# Altium schematic sheet nucleo_es_egyszerubb_dolgok.SchDoc
size A4
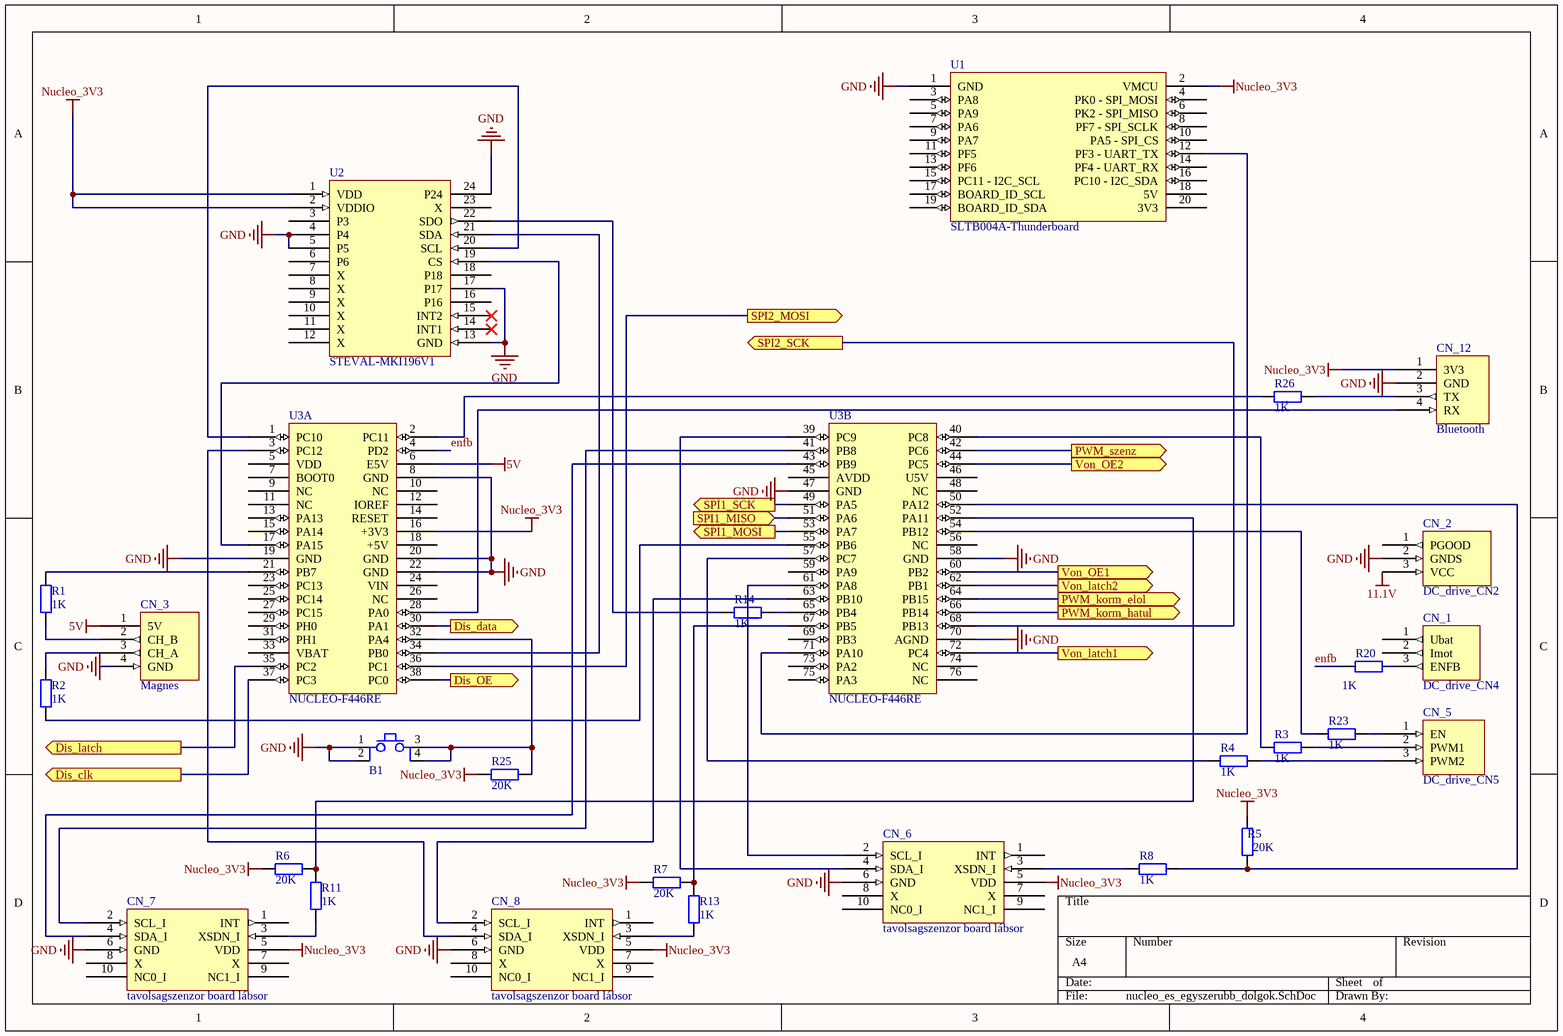
[diagram p0: nucleo_es_egyszerubb_dolgok.SchDoc]

## Parts
B1  Button  [FP_BTN_SMD]  (value not drawn)
CN_1  DC_drive_CN4  [DC_Drive_CN_Stelvio]
CN_2  DC_drive_CN2  [DC_Drive_CN_Stelvio]
CN_3  Magnes  [FP_CONN4_TAP_254MM]
CN_5  DC_drive_CN5  [DC_Drive_CN_Stelvio]
CN_6  tavolsagszenzor board lábsor  [6P konnektor (távolságszenzor)]
CN_7  tavolsagszenzor board lábsor  [6P konnektor (távolságszenzor)]
CN_8  tavolsagszenzor board lábsor  [6P konnektor (távolságszenzor)]
CN_12  Bluetooth  [FP_CONN4_TAP_254MM_90]
R1  1K  [FP_0603_RES]
R2  1K  [FP_0603_RES]
R3  1K  [FP_0603_RES]
R4  1K  [FP_0603_RES]
R5  20K  [FP_0603_RES]
R6  20K  [FP_0603_RES]
R7  20K  [FP_0603_RES]
R8  1K  [FP_0603_RES]
R11  1K  [FP_0603_RES]
R13  1K  [FP_0603_RES]
R14  1K  [FP_0603_RES]
R20  1K  [FP_0603_RES]
R23  1K  [FP_0603_RES]
R25  20K  [FP_0603_RES]
R26  1K  [FP_0603_RES]
U1  SLTB004A-Thunderboard  [SLTB004A]
U2  STEVAL-MKI196V1  [STEVAL IMU 20 tüske anya]
U3  NUCLEO-F446RE  [FP_NUCLEO-64]  (parts A,B of 2)

## Ports
Dis_clk (out), Dis_data (out), Dis_latch (out), Dis_OE (out), PWM_korm_elol (out), PWM_korm_hatul (out), PWM_szenz (out), SPI1_MISO (in), SPI1_MOSI (out), SPI1_SCK (out), SPI2_MOSI (out), SPI2_SCK (out), Von_latch1 (out), Von_latch2 (out), Von_OE1 (out), Von_OE2 (out)

## Nets
5V: CN_3.1(5V) U3.6(E5V)
11.1V: CN_2.3(VCC)
GND: B1.1 B1.2 CN_2.2(GNDS) CN_3.4(GND) CN_6.6(GND) CN_7.6(GND) CN_8.6(GND) CN_12.2(GND) U1.1(GND) U2.4(P4) U2.5(P5) U2.13(GND) U2.17(P17) U2.24(P24) U3.8(GND) U3.19(GND) U3.20(GND) U3.22(GND) U3.47(GND) U3.58(GND) U3.70(AGND)
Nucleo_3V3: CN_6.5(VDD) CN_7.5(VDD) CN_8.5(VDD) CN_12.1(3V3) R5.2 R6.1 R7.1 R25.1 U1.2(VMCU) U2.1(VDD) U2.2(VDDIO) U3.16(+3V3)
Dis_clk: U3.37(PC3) ; port Dis_clk
Dis_data: U3.30(PA1) ; port Dis_data
Dis_latch: U3.35(PC2) ; port Dis_latch
Dis_OE: U3.38(PC0) ; port Dis_OE
enfb: R20.1 U3.4(PD2)
PWM_korm_elol: U3.64(PB15) ; port PWM_korm_elol
PWM_korm_hatul: U3.66(PB14) ; port PWM_korm_hatul
PWM_szenz: U3.42(PC6) ; port PWM_szenz
SPI1_MISO: U3.51(PA6) ; port SPI1_MISO
SPI1_MOSI: U3.53(PA7) ; port SPI1_MOSI
SPI1_SCK: U3.49(PA5) ; port SPI1_SCK
SPI2_MOSI: U3.36(PC1) ; port SPI2_MOSI
SPI2_SCK: U3.68(PB13) ; port SPI2_SCK
Von_latch1: U3.72(PC4) ; port Von_latch1
Von_latch2: U3.62(PB1) ; port Von_latch2
Von_OE1: U3.60(PB2) ; port Von_OE1
Von_OE2: U3.44(PC5) ; port Von_OE2
NetB1_3: B1.3 B1.4 R25.2 U3.32(PA4)
NetCN_1_3: CN_1.3(ENFB) R20.2
NetCN_3_2: CN_3.2(CH_B) R1.1
NetCN_3_3: CN_3.3(CH_A) R2.2
NetCN_5_1: CN_5.1(EN) R23.2
NetCN_5_2: CN_5.2(PWM1) R3.2
NetCN_5_3: CN_5.3(PWM2) R4.2
NetCN_6_2: CN_6.2(SCL_I) U3.61(PA8)
NetCN_6_3: CN_6.3(XSDN_I) R8.1
NetCN_6_4: CN_6.4(SDA_I) U3.39(PC9)
NetCN_7_2: CN_7.2(SCL_I) U3.41(PB8)
NetCN_7_3: CN_7.3(XSDN_I) R11.1
NetCN_7_4: CN_7.4(SDA_I) U3.43(PB9)
NetCN_8_2: CN_8.2(SCL_I) U3.63(PB10)
NetCN_8_3: CN_8.3(XSDN_I) R13.1
NetCN_8_4: CN_8.4(SDA_I) U3.3(PC12)
NetCN_12_3: CN_12.3(TX) R26.2
NetCN_12_4: CN_12.4(RX) U3.28(PA0)
NetR1_2: R1.2 U3.21(PB7)
NetR2_1: R2.1 U3.55(PB6)
NetR3_1: R3.1 U3.40(PC8)
NetR4_1: R4.1 U3.57(PC7)
NetR5_1: R5.1 R8.2 U3.50(PA12)
NetR6_2: R6.2 R11.2 U3.52(PA11)
NetR7_2: R7.2 R13.2 U3.67(PB5)
NetR14_1: R14.1 U2.22(SDO)
NetR14_2: R14.2 U3.65(PB4)
NetR23_1: R23.1 U3.54(PB12)
NetR26_1: R26.1 U3.2(PC11)
NetU1_12: U1.12(PF3_-_UART_TX) U3.71(PA10)
NetU2_19: U2.19(CS) U3.17(PA15)
NetU2_20: U2.20(SCL) U3.1(PC10)
NetU2_21: U2.21(SDA) U3.34(PB0)

Not connected (* = marked no-connect by the designer): CN_1 1(Ubat) 2(Imot); CN_2 1(PGOOD); CN_6 1(INT) 7(X) 8(X) 9(NC1_I) 10(NC0_I); CN_7 1(INT) 7(X) 8(X) 9(NC1_I) 10(NC0_I); CN_8 1(INT) 7(X) 8(X) 9(NC1_I) 10(NC0_I); U1 3(PA8) 4(PK0_-_SPI_MOSI) 5(PA9) 6(PK2_-_SPI_MISO) 7(PA6) 8(PF7_-_SPI_SCLK) 9(PA7) 10(PA5_-_SPI_CS) 11(PF5) 13(PF6) 14(PF4_-_UART_RX) 15(PC11_-_I2C_SCL) 16(PC10_-_I2C_SDA) 17(BOARD_ID_SCL) 18(5V) 19(BOARD_ID_SDA) 20(3V3); U2 3(P3) 6(P6) 7(X) 8(X) 9(X) 10(X) 11(X) 12(X) 14(INT1)* 15(INT2)* 16(P16) 18(P18) 23(X); U3 5(VDD) 7(BOOT0) 9(NC) 10(NC) 11(NC) 12(IOREF) 13(PA13) 14(RESET) 15(PA14) 18(+5V) 23(PC13) 24(VIN) 25(PC14) 26(NC) 27(PC15) 29(PH0) 31(PH1) 33(VBAT) 45(AVDD) 46(U5V) 48(NC) 56(NC) 59(PA9) 69(PB3) 73(PA2) 74(NC) 75(PA3) 76(NC)

## Library data of the parts
B1 = Button 4P: Push button
CN_1 = DC_drive_CN4: CN4 a motvez kártyán a neve
CN_2 = DC_drive_CN2: CN2 a motvez kártyán a neve; supplier: AUT
CN_3 = Encoder: A1333; Supplier: AUT
CN_5 = DC_drive_CN5: CN5 a motvez kártyán a neve; supplier: AUT
CN_6-CN_8 = VL53L1X-satel: megvan: igen; supplier: ST
CN_12 = HC-05: HC-05 tokozva, kérdés, hogy melyik lábon vannak valójában a dolgok; reference2: 100.355.62 (gomb nélkül); reference1: 100.416.39 (gombbal); reference3: 100.355.65 (master-slave); supplier: hestore
R1-R8 R11 R13 R14 R20 R23 R25 R26 = RES: Resistor
  R1-R4 R8 R11 R13 R14 R20 R23 R26: Value: 1K
  R5-R7 R25: Value: 20K
U1 = SLTB004A: SiLabs Thunderboard Sense 2 module
U2 = STEVAL-MKI176V1: LSM6DS3H, SPI
U3 = NUCLEO-F446RE: Reference: NUCLEO; Name: Nucleo F446RE; Supplier: Tanszék